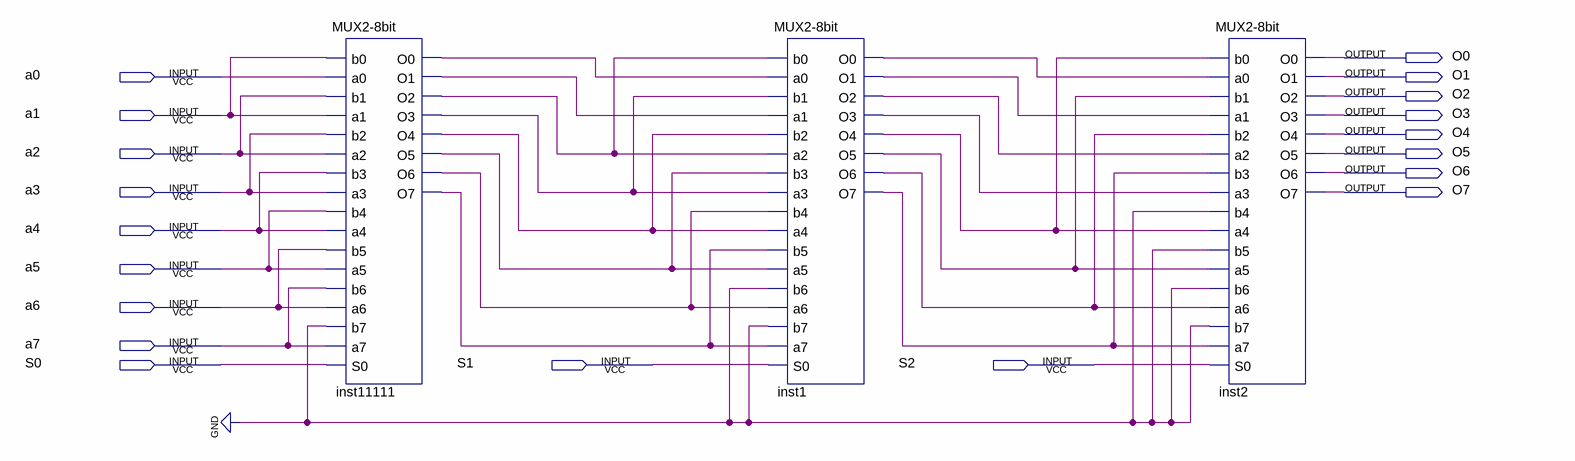
[diagram p0: schematic sheet]
// Quartus schematic BarrelShifter.bdf as structural Verilog: 3 symbols, 19 pins
module BarrelShifter (
  input  a0,
  input  a1,
  input  a2,
  input  a3,
  input  a4,
  input  a5,
  input  a6,
  input  a7,
  input  S0,
  input  S1,
  input  S2,
  output O0,
  output O1,
  output O2,
  output O3,
  output O4,
  output O5,
  output O6,
  output O7
);

  wire inst1_o0, inst1_o1, inst1_o2, inst1_o3, inst1_o4, inst1_o5, inst1_o6, inst1_o7, inst11111_o0,
       inst11111_o1, inst11111_o2, inst11111_o3, inst11111_o4, inst11111_o5, inst11111_o6, inst11111_o7;

  \MUX2-8bit  inst11111 (
    .b0(a1), .a0(a0), .b1(a2), .a1(a1), .b2(a3), .a2(a2), .b3(a4), .a3(a3), .b4(a5), .a4(a4), .b5(a6),
    .a5(a5), .b6(a7), .a6(a6), .b7(1'b0), .a7(a7), .S0(S0), .O0(inst11111_o0), .O1(inst11111_o1),
    .O2(inst11111_o2), .O3(inst11111_o3), .O4(inst11111_o4), .O5(inst11111_o5), .O6(inst11111_o6),
    .O7(inst11111_o7));
  \MUX2-8bit  inst1 (
    .b0(inst11111_o2), .a0(inst11111_o0), .b1(inst11111_o3), .a1(inst11111_o1), .b2(inst11111_o4),
    .a2(inst11111_o2), .b3(inst11111_o5), .a3(inst11111_o3), .b4(inst11111_o6), .a4(inst11111_o4),
    .b5(inst11111_o7), .a5(inst11111_o5), .b6(1'b0), .a6(inst11111_o6), .b7(1'b0), .a7(inst11111_o7),
    .S0(S1), .O0(inst1_o0), .O1(inst1_o1), .O2(inst1_o2), .O3(inst1_o3), .O4(inst1_o4), .O5(inst1_o5),
    .O6(inst1_o6), .O7(inst1_o7));
  \MUX2-8bit  inst2 (
    .b0(inst1_o4), .a0(inst1_o0), .b1(inst1_o5), .a1(inst1_o1), .b2(inst1_o6), .a2(inst1_o2), .b3(inst1_o7),
    .a3(inst1_o3), .b4(1'b0), .a4(inst1_o4), .b5(1'b0), .a5(inst1_o5), .b6(1'b0), .a6(inst1_o6), .b7(1'b0),
    .a7(inst1_o7), .S0(S2), .O0(O0), .O1(O1), .O2(O2), .O3(O3), .O4(O4), .O5(O5), .O6(O6), .O7(O7));
endmodule
